# Altium schematic sheet Controller.SchDoc
size A3
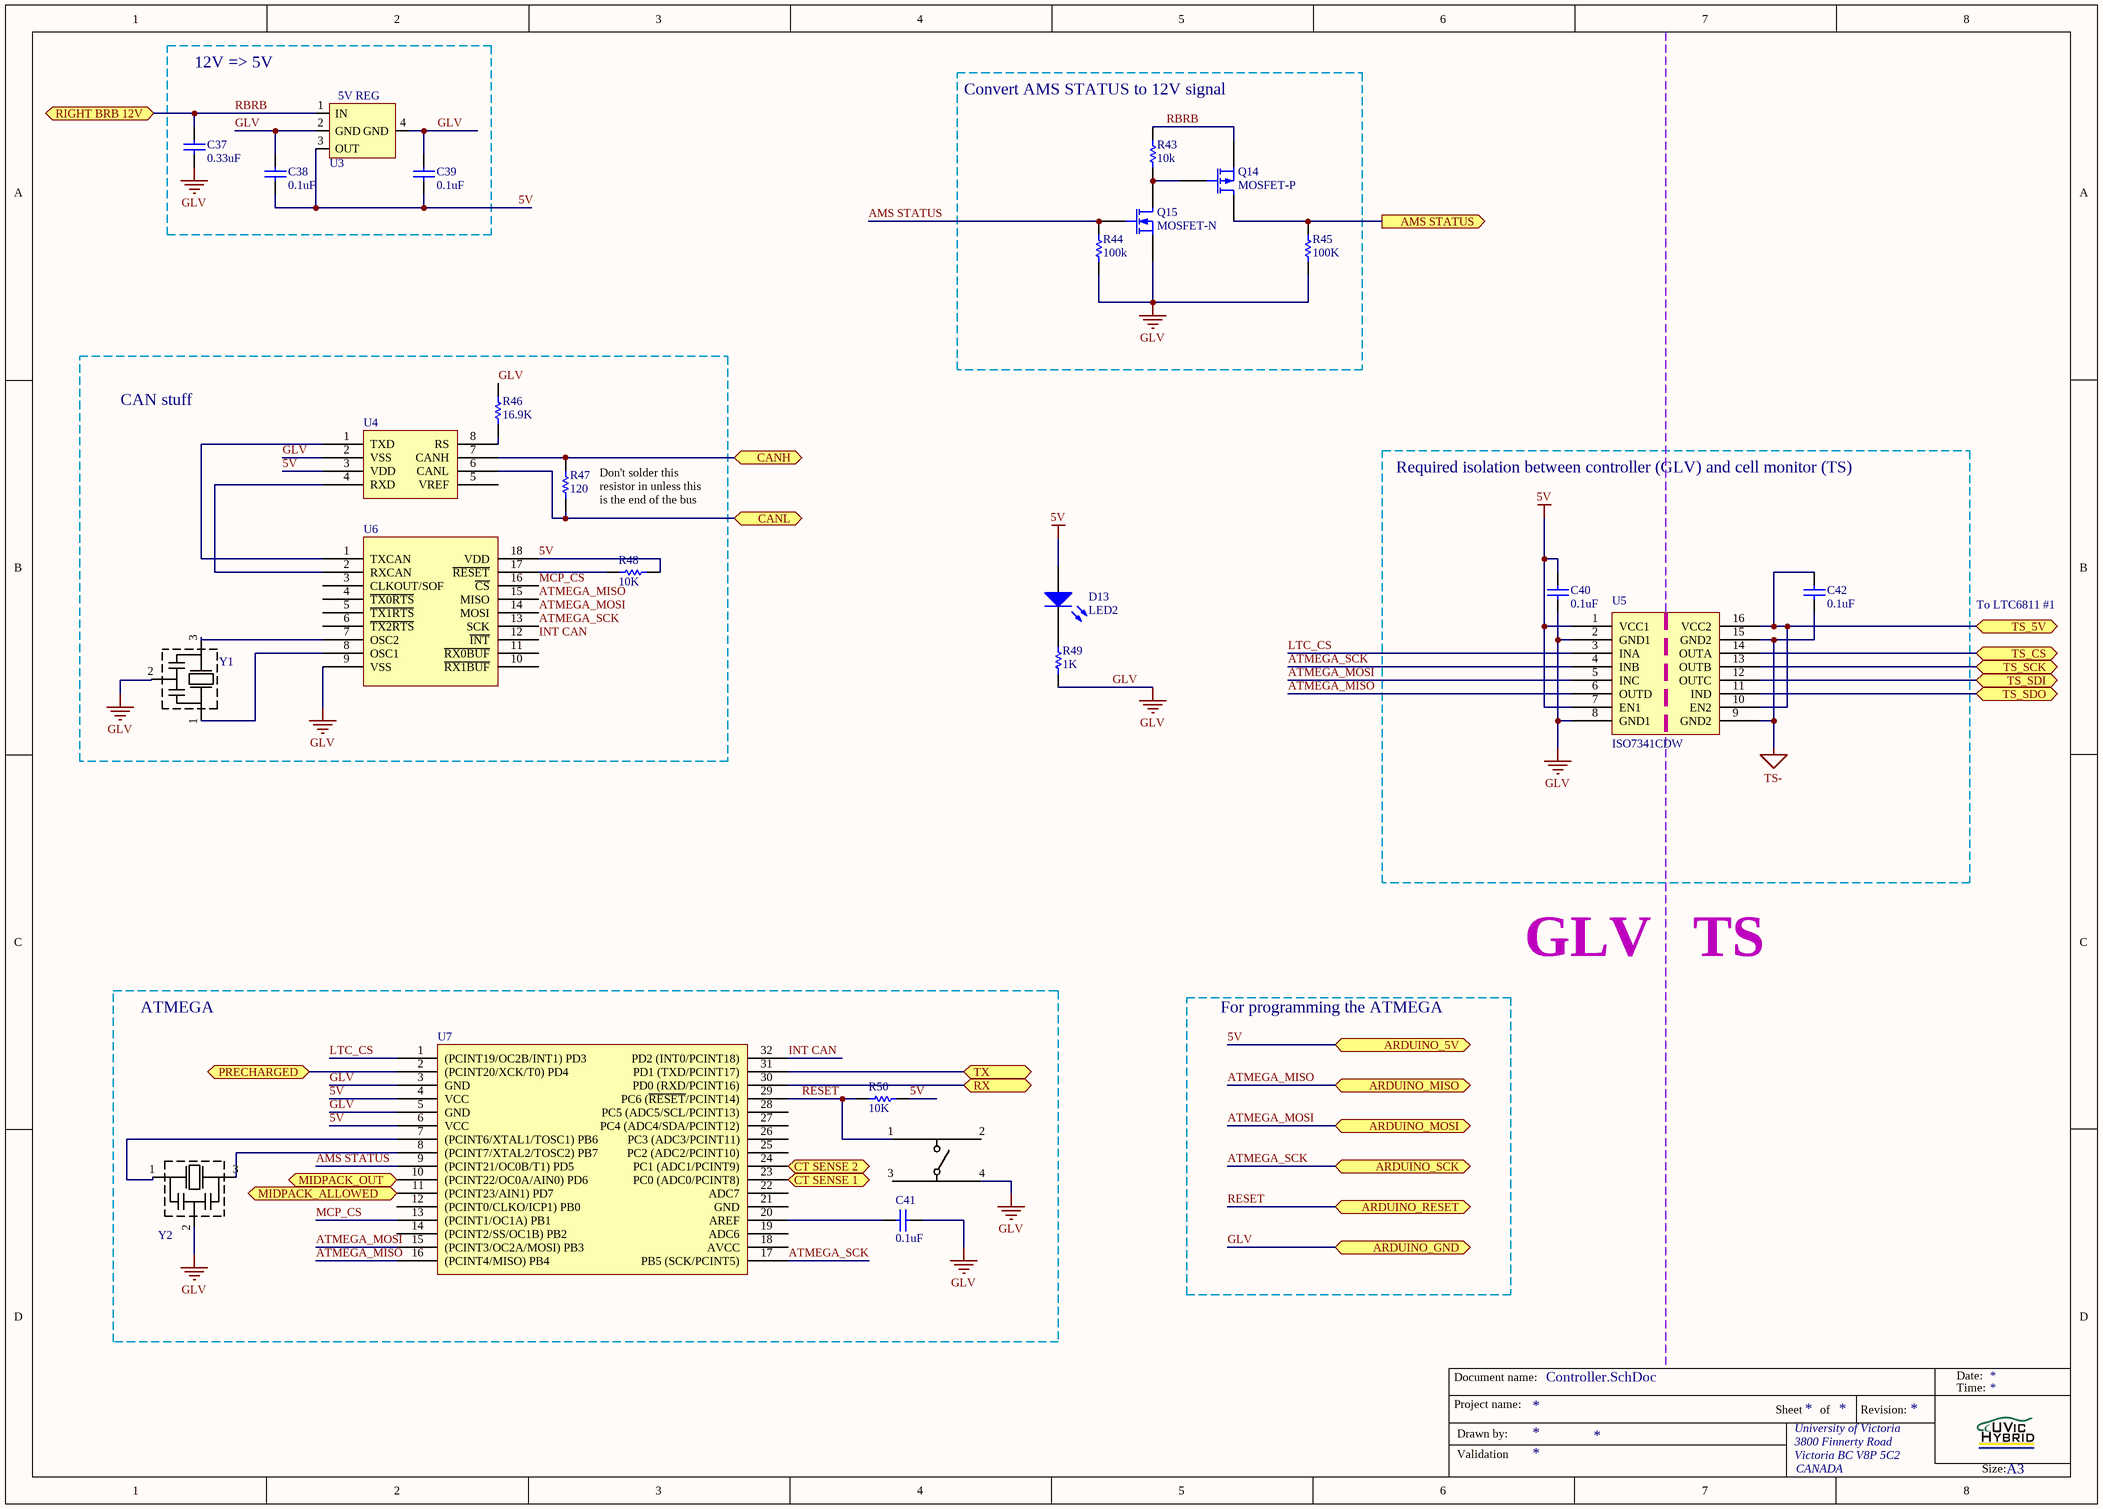
[diagram p0: Controller.SchDoc]

## Parts
C37  0.33uF  [C1206]
C38  0.1uF  [0603 IMPERIAL]
C39  0.1uF  [0603 IMPERIAL]
C40  0.1uF  [0603 IMPERIAL]
C41  0.1uF  [0603 IMPERIAL]
C42  0.1uF  [0603 IMPERIAL]
D13  LED2  [3.2X1.6X1.1]
Q14  MOSFET-P  [SOT23f]
Q15  MOSFET-N  [SOT23f]
R43  10k  [0603 IMPERIAL]
R44  100k  [0603 IMPERIAL]
R45  100K  [0603 IMPERIAL]
R46  16.9K  [0603 IMPERIAL]
R47  120  [0603 IMPERIAL]
R48  10K  [0603 IMPERIAL]
R49  1K  [0603 IMPERIAL]
R50  10K  [0603 IMPERIAL]
SW1  PTS525SM15SMTR2  [PTS525SM15SMTR2]  (value not drawn)
U3  UA7805CKTTR  [SOT223]  (value not drawn)
U4  MCP2551-E/SN  [SOIC127P600X175-8M]  (value not drawn)
U5  ISO7341CDW  [SOIC16-WB]
U6  MCP2515-E/ST  [SOIC127P1030X265-18M]  (value not drawn)
U7  ATMEGA328P  [ATMEGA328P-15AZ - 2]  (value not drawn)
Y1  CSTCE16M0V53-R0  [CSTCE16M0V53-R0]  (value not drawn)
Y2  CSTCE16M0V53-R0  [CSTCE16M0V53-R0]  (value not drawn)

## Blocks framed on the sheet
12V => 5V: C37-C39 U3
Convert AMS STATUS to 12V signal: Q14 Q15 R43-R45
CAN stuff: R46-R48 U4 U6 Y1
ATMEGA: C41 R50 SW1 U7 Y2

## Ports
AMS STATUS (out), ARDUINO_5V, ARDUINO_GND, ARDUINO_MISO, ARDUINO_MOSI, ARDUINO_RESET, ARDUINO_SCK, CANH, CANL, CT SENSE 1, CT SENSE 2, MIDPACK_ALLOWED, MIDPACK_OUT, PRECHARGED, RIGHT BRB 12V, RX, TS_5V, TS_CS, TS_SCK, TS_SDI, TS_SDO, TX

## Nets
5V: C38.1 C39.1 C40.2 D13.1(A) R48.2 R50.2 U3.3(OUT) U4.3(VDD) U5.1(VCC1) U5.7(EN1) U6.18(VDD) U7.4(VCC) U7.6(VCC) ; port ARDUINO_5V
GLV: C37.1 C38.2 C39.2 C40.1 C41.2 Q15.3(S) R44.1 R45.1 R46.2 R49.1 SW1.4 U3.2(GND) U3.4(GND) U4.2(VSS) U5.2(GND1) U5.8(GND1) U6.9(VSS) U7.3(GND) U7.5(GND) Y1.2 Y2.2 ; port ARDUINO_GND
TS-: C42.1 U5.9(GND2) U5.15(GND2)
AMS STATUS: Q15.2(G) R44.2 U7.9((PCINT21/OC0B/T1)_PD5)
AMS STATUS: Q14.1(D) R45.2 ; port AMS STATUS  [a separate net that carries the same name]
ATMEGA_MISO: U5.6(OUTD) U6.15(MISO) U7.16((PCINT4/MISO)_PB4) ; port ARDUINO_MISO
ATMEGA_MOSI: U5.5(INC) U6.14(MOSI) U7.15((PCINT3/OC2A/MOSI)_PB3) ; port ARDUINO_MOSI
ATMEGA_SCK: U5.4(INB) U6.13(SCK) U7.17(PB5_(SCK/PCINT5)) ; port ARDUINO_SCK
CANH: R47.2 U4.7(CANH) ; port CANH
CANL: R47.1 U4.6(CANL) ; port CANL
CT SENSE 1: U7.23(PC0_(ADC0/PCINT8)) ; port CT SENSE 1
CT SENSE 2: U7.24(PC1_(ADC1/PCINT9)) ; port CT SENSE 2
INT CAN: U6.12(~{INT}) U7.32(PD2_(INT0/PCINT18))
LTC_CS: U5.3(INA) U7.1((PCINT19/OC2B/INT1)_PD3)
MCP_CS: U6.16(~{CS}) U7.13((PCINT1/OC1A)_PB1)
MIDPACK_ALLOWED: U7.11((PCINT23/AIN1)_PD7) ; port MIDPACK_ALLOWED
MIDPACK_OUT: U7.10((PCINT22/OC0A/AIN0)_PD6) ; port MIDPACK_OUT
PRECHARGED: U7.2((PCINT20/XCK/T0)_PD4) ; port PRECHARGED
RBRB: C37.2 Q14.3(S) R43.2 U3.1(IN) ; port RIGHT BRB 12V
RESET: R50.1 SW1.1 U7.29(PC6_(~{RESET}/PCINT14)) ; port ARDUINO_RESET
RX: U7.30(PD0_(RXD/PCINT16)) ; port RX
TS_5V: C42.2 U5.10(EN2) U5.16(VCC2) ; port TS_5V
TS_CS: U5.14(OUTA) ; port TS_CS
TS_SCK: U5.13(OUTB) ; port TS_SCK
TS_SDI: U5.12(OUTC) ; port TS_SDI
TS_SDO: U5.11(IND) ; port TS_SDO
TX: U7.31(PD1_(TXD/PCINT17)) ; port TX
NetC41_1: C41.1 U7.20(AREF)
NetD13_2: D13.2(K) R49.2
NetQ14_2: Q14.2(G) Q15.1(D) R43.1
NetR46_1: R46.1 U4.8(RS)
NetR48_1: R48.1 U6.17(~{RESET})
NetU4_1: U4.1(TXD) U6.1(TXCAN)
NetU4_4: U4.4(RXD) U6.2(RXCAN)
NetU6_7: U6.7(OSC2) Y1.3
NetU6_8: U6.8(OSC1) Y1.1
NetU7_7: U7.7((PCINT6/XTAL1/TOSC1)_PB6) Y2.1
NetU7_8: U7.8((PCINT7/XTAL2/TOSC2)_PB7) Y2.3

Not connected (* = marked no-connect by the designer): SW1 2 3; U4 5(VREF); U6 3(CLKOUT/SOF) 4(~{TX0RTS}) 5(~{TX1RTS}) 6(~{TX2RTS}) 10(~{RX1BUF}) 11(~{RX0BUF}); U7 12((PCINT0/CLKO/ICP1)_PB0) 14((PCINT2/SS/OC1B)_PB2) 18(AVCC) 19(ADC6) 21(GND) 22(ADC7) 25(PC2_(ADC2/PCINT10)) 26(PC3_(ADC3/PCINT11)) 27(PC4_(ADC4/SDA/PCINT12)) 28(PC5_(ADC5/SCL/PCINT13))

## Notes on the sheet
- (near R47) Don't solder this resistor in unless this is the end of the bus
- Required isolation between controller (GLV) and cell monitor (TS)
- To LTC6811 #1
- GLV
- TS
- For programming the ATMEGA
- Document name:
- Date:
- Time:
- Project name:
- Drawn by:
- Validation
- Sheet
- University of Victoria
- 3800 Finnerty Road
- Victoria BC V8P 5C2
- of
- Revision:
- CANADA
- Size:
- A3
- (in symbol UA7805CKTTR) 5V REG

## Library data of the parts
C37 = Cap Semi: Capacitor (Semiconductor SIM Model); Published: 8-Jun-2000; LatestRevisionDate: 29-May-2009; LatestRevisionNote: IPC-7351 Footprint Added.; PackageReference: C1206; Publisher: Altium Limited; PackageDescription: Chip Capacitor; Value: 0.33uF; Supplier Part Number: 445-4464-1-ND
C38-C42 = Cap: Capacitor; Published: 8-Jun-2000; LatestRevisionDate: 17-Jul-2002; LatestRevisionNote: Re-released for DXP Platform.; Publisher: Altium Limited; Value: 0.1uF; Supplier Part Number: 399-1095-1-ND
D13 = LED2: Typical RED, GREEN, YELLOW, AMBER GaAs LED; Published: 8-Jun-2000; LatestRevisionDate: 17-Jul-2002; LatestRevisionNote: Re-released for DXP Platform.; PackageVersion: Feb-2002; PackageReference: 3.2X1.6X1.1; Publisher: Altium Limited; PackageDescription: SM LED; 2 Flat Leads; Supplier Part Number: 160-1456-1-ND
Q14 = MOSFET-P: P-Channel MOSFET; Published: 8-Jun-2000; LatestRevisionDate: 17-Jul-2002; LatestRevisionNote: Re-released for DXP Platform.; PackageVersion: 1995/1996; PackageReference: E3; Publisher: Altium Limited; PackageDescription: TO, Flat Index; 3 In-Line, Axial Leads; Body Dia. 4.6mm; Lead Dia. 0.5 mm (max); Supplier Part Number: BSS308PE H6327CT-ND
Q15 = MOSFET-N: N-Channel MOSFET; Published: 8-Jun-2000; LatestRevisionDate: 17-Jul-2002; LatestRevisionNote: Re-released for DXP Platform.; PackageVersion: 1995/1996; PackageReference: E3; Publisher: Altium Limited; PackageDescription: TO, Flat Index; 3 In-Line, Axial Leads; Body Dia. 4.6mm; Lead Dia. 0.5 mm (max); Supplier Part Number: DMN3404LDICT-ND
R43 R45-R50 = Res1: Resistor
  R43 R48 R50: Value: 10K; Supplier Part Number: MCT0603-10.0K-CFCT-ND
  R45: Value: 100K; Supplier Part Number: RR08P100KDCT-ND
  R46: Value: 16.9K; Supplier Part Number: P16.9KDBCT-ND
  R47: Value: 120; Supplier Part Number: 311-120HRCT-ND
  R49: Value: 1K; Supplier Part Number: 311-1.0KGRCT-ND
R44 = Res1: Resistor; Value: 10K; Supplier Part Number: RR08P100KDCT-ND
U3 = UA7805CKTTR: 12V to 5V LDO; Supplier Part Number: 296-12290-6-ND
U4 = MCP2551-E/SN: SOIC; Supplier Part Number: MCP2551-E/SN-ND
U6 = MCP2515-E/ST: SOIC; Supplier Part Number: MCP2515-I/SO-ND
U7 = ATMEGA328P: TQFN; Supplier 1: Digi-Key; Supplier Part Number: ATMEGA328P-AU-ND
SW1 = PTS525SM15SMTR2: Supplier 1: Digi-Key; Supplier Part Number: CKN9104CT-ND
Y1 Y2 = CSTCE16M0V53-R0: Supplier Part Number: 490-1198-1-ND